# EAGLE schematic mixJTAG240 (EAGLE 6.4)
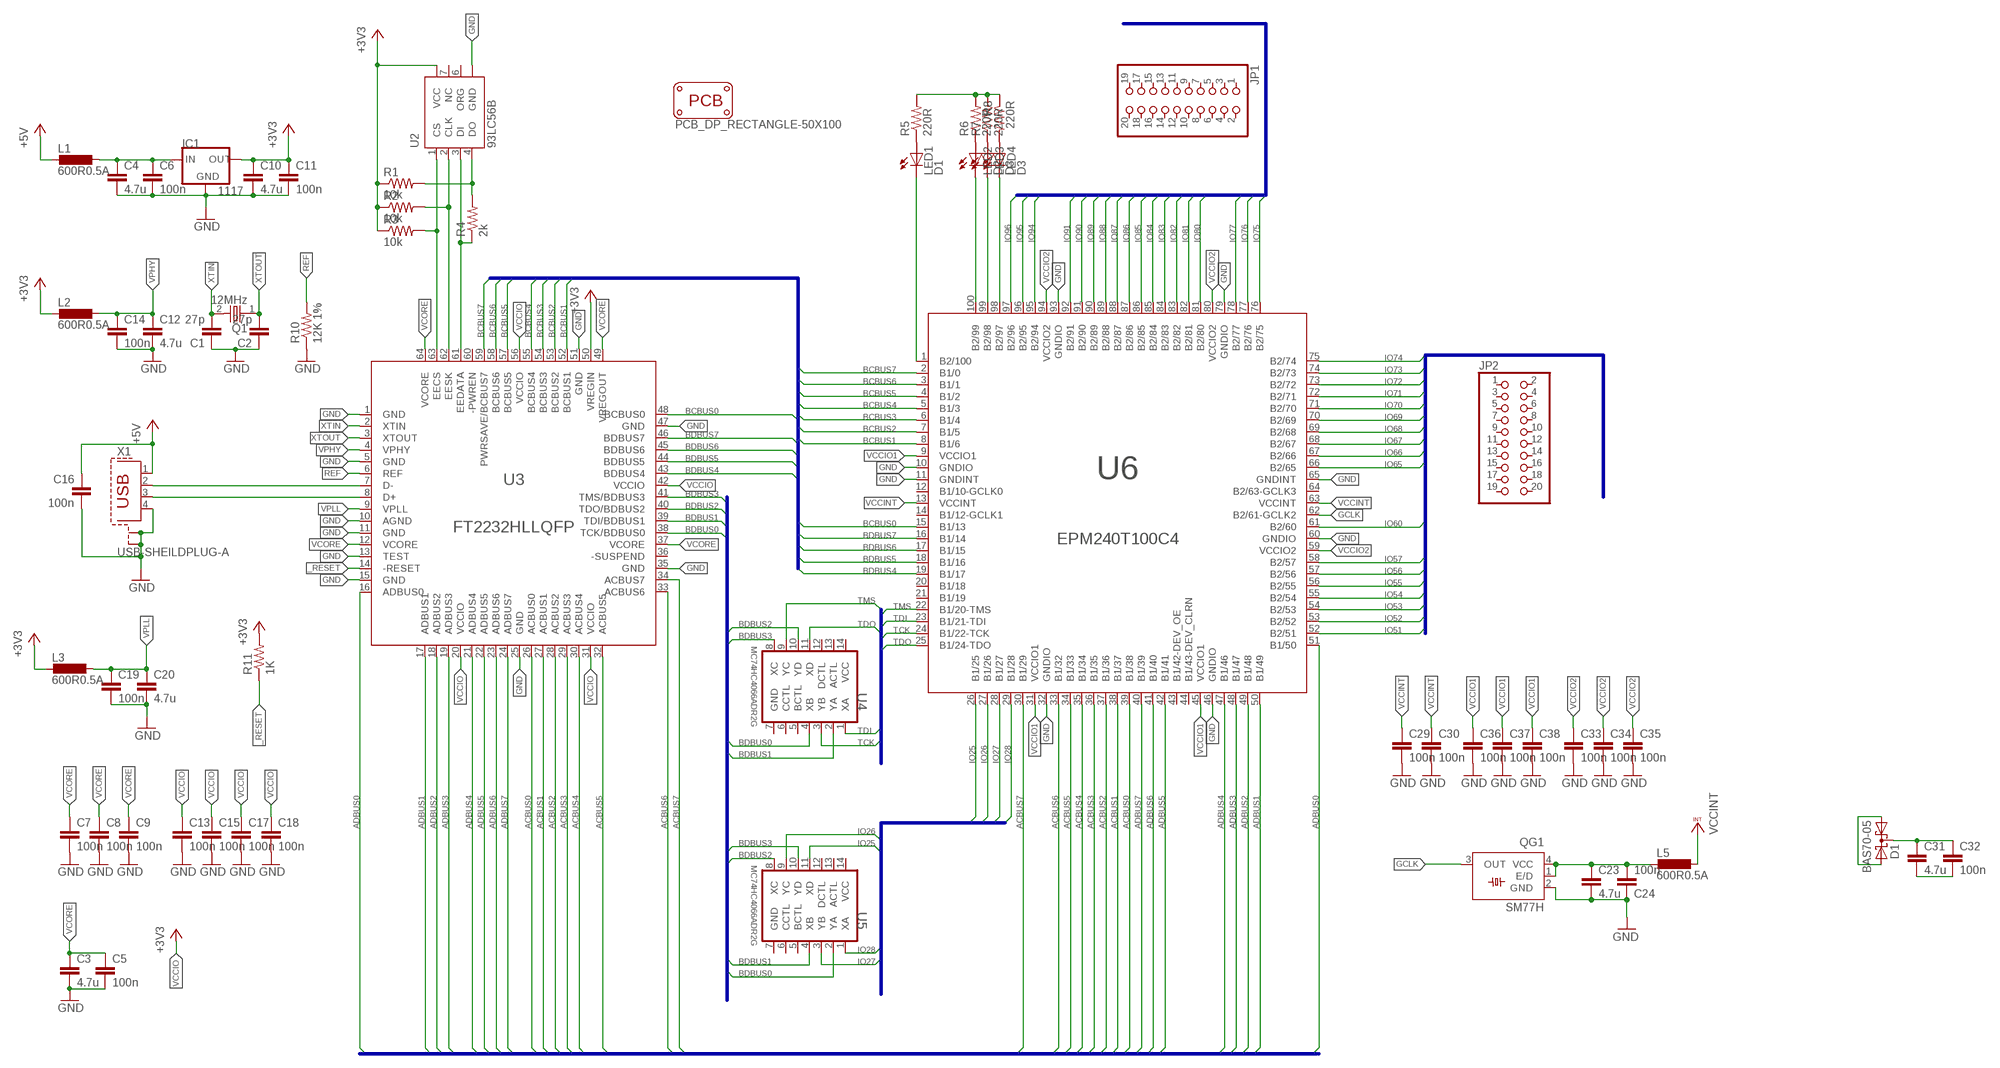
[diagram p0: schematic, sheet 1]

## Parts
C1  27p  C-EU025-025X050  [C025-025X050]
C2  27p  C-EU025-025X050  [C025-025X050]
C3  4.7u  C-EUC0805K  [C0805K]
C4  4.7u  C-EUC0805K  [C0805K]
C5  100n  C-EUC0805  [C0805]
C6  100n  C-EUC0805  [C0805]
C7  100n  C-EUC0805  [C0805]
C8  100n  C-EUC0805  [C0805]
C9  100n  C-EUC0805  [C0805]
C10  4.7u  C-EUC0805K  [C0805K]
C11  100n  C-EUC0805  [C0805]
C12  4.7u  C-EUC0805K  [C0805K]
C13  100n  C-EUC0805  [C0805]
C14  100n  C-EUC0805  [C0805]
C15  100n  C-EUC0805  [C0805]
C16  100n  C-EUC0805  [C0805]
C17  100n  C-EUC0805  [C0805]
C18  100n  C-EUC0805  [C0805]
C19  100n  C-EUC0805  [C0805]
C20  4.7u  C-EUC0805K  [C0805K]
C23  4.7u  C-EUC0805K  [C0805K]
C24  100n  C-EUC0805  [C0805]
C29  100n  C-EUC0805  [C0805]
C30  100n  C-EUC0805  [C0805]
C31  4.7u  C-EUC0805K  [C0805K]
C32  100n  C-EUC0805  [C0805]
C33  100n  C-EUC0805  [C0805]
C34  100n  C-EUC0805  [C0805]
C35  100n  C-EUC0805  [C0805]
C36  100n  C-EUC0805  [C0805]
C37  100n  C-EUC0805  [C0805]
C38  100n  C-EUC0805  [C0805]
D1  BAS70-05  [SOT23]
IC1  1117  AMS1117  [SOT223]
JP1  PINHD-2X10  [2X10]
JP2  PINHD-2X10  [2X10]
L1  600R0.5A  DO3316P  [R0805]
L2  600R0.5A  DO3316P  [R0805]
L3  600R0.5A  DO3316P  [R0805]
L5  600R0.5A  DO3316P  [R0805]
LED1  D1  LEDCHIPLED_0805  [CHIPLED_0805]
LED2  D2  LEDCHIPLED_0805  [CHIPLED_0805]
LED3  D3  LEDCHIPLED_0805  [CHIPLED_0805]
LED4  D3  LEDCHIPLED_0805  [CHIPLED_0805]
PCB1  PCB_DP_RECTANGLE-50X100  [DP10050_V1]
Q1  12MHz  XT  [HC49/S]
QG1  SM77H  [SM77H]
R1  10k  R-US_R0805  [R0805]
R2  10k  R-US_R0805  [R0805]
R3  10k  R-US_R0805  [R0805]
R4  2k  R-US_R0805  [R0805]
R5  220R  R-US_R0805  [R0805]
R6  220R  R-US_R0805  [R0805]
R7  220R  R-US_R0805  [R0805]
R8  220R  R-US_R0805  [R0805]
R10  12K 1%  R-US_R0805  [R0805]
R11  1K  R-US_R0805  [R0805]
U2  93LC56B  PIN2PIN-SOIC8  [SOIC8]
U3  FT2232HLLQFP  [LQFP-64]
U4  MC74HC4066ADR2G  [SOIC127P600X175-14N]
U5  MC74HC4066ADR2G  [SOIC127P600X175-14N]
U6  EPM240T100C4  [TQFP100]
X1  USB-SHEILDPLUG-A  [USB-A-HOLE-PLUG]

## Nets
+3V3: C10.1 C11.1 IC1.2(OUT) L2.1 L3.1 R1.1 R2.1 R3.1 R11.2 U2.8(VCC) U3.50(VREGIN)
+5V: C16.1 L1.1 X1.1
_RESET: R11.1 U3.14(-RESET)
ACBUS0: U3.26(ACBUS0) U6.39(B1/38)
ACBUS1: U3.27(ACBUS1) U6.38(B1/37)
ACBUS2: U3.28(ACBUS2) U6.37(B1/36)
ACBUS3: U3.29(ACBUS3) U6.36(B1/35)
ACBUS4: U3.30(ACBUS4) U6.35(B1/34)
ACBUS5: U3.32(ACBUS5) U6.34(B1/33)
ACBUS6: U3.33(ACBUS6) U6.33(B1/32)
ACBUS7: U3.34(ACBUS7) U6.30(B1/29)
ADBUS0: U3.16(ADBUS0) U6.51(B1/50)
ADBUS1: U3.17(ADBUS1) U6.50(B1/49)
ADBUS2: U3.18(ADBUS2) U6.49(B1/48)
ADBUS3: U3.19(ADBUS3) U6.48(B1/47)
ADBUS4: U3.21(ADBUS4) U6.47(B1/46)
ADBUS5: U3.22(ADBUS5) U6.42(B1/41)
ADBUS6: U3.23(ADBUS6) U6.41(B1/40)
ADBUS7: U3.24(ADBUS7) U6.40(B1/39)
BCBUS0: U3.48(BCBUS0) U6.15(B1/13)
BCBUS1: U3.52(BCBUS1) U6.8(B1/6)
BCBUS2: U3.53(BCBUS2) U6.7(B1/5)
BCBUS3: U3.54(BCBUS3) U6.6(B1/4)
BCBUS4: U3.55(BCBUS4) U6.5(B1/3)
BCBUS5: U3.57(BCBUS5) U6.4(B1/2)
BCBUS6: U3.58(BCBUS6) U6.3(B1/1)
BCBUS7: U3.59(PWRSAVE/BCBUS7) U6.2(B1/0)
BDBUS0: U3.38(TCK/BDBUS0) U4.4(XB) U5.2(YA)
BDBUS1: U3.39(TDI/BDBUS1) U4.2(YA) U5.4(XB)
BDBUS2: U3.40(TDO/BDBUS2) U4.10(YD) U5.8(XC)
BDBUS3: U3.41(TMS/BDBUS3) U4.8(XC) U5.10(YD)
BDBUS4: U3.43(BDBUS4) U6.19(B1/17)
BDBUS5: U3.44(BDBUS5) U6.18(B1/16)
BDBUS6: U3.45(BDBUS6) U6.17(B1/15)
BDBUS7: U3.46(BDBUS7) U6.16(B1/14)
EECS: R3.2 U2.1(CS) U3.63(EECS)
EEDATA: R4.1 U2.3(DI) U3.61(EEDATA)
EESK: R2.2 U2.2(CLK) U3.62(EESK)
GCLK: QG1.3(OUT) U6.62(B2/61-GCLK2)
GND: C1.1 C2.1 C3.2 C4.2 C5.2 C6.2 C7.2 C8.2 C9.2 C10.2 C11.2 C12.2 C13.2 C14.2 C15.2 C16.2 C17.2 C18.2 C19.2 C20.2 C23.2 C24.1 C29.2 C30.2 C33.2 C34.2 C35.2 C36.2 C37.2 C38.2 IC1.1(GND) QG1.2(GND) R10.1 U2.5(GND) U3.1(GND) U3.5(GND) U3.10(AGND) U3.11(GND) U3.13(TEST) U3.15(GND) U3.25(GND) U3.35(GND) U3.47(GND) U3.51(GND) U6.10(GNDIO) U6.11(GNDINT) U6.32(GNDIO) U6.46(GNDIO) U6.60(GNDIO) U6.65(GNDINT) U6.79(GNDIO) U6.93(GNDIO) X1.4 X1.S1 X1.S2
IO25: U5.11(XD) U6.26(B1/25)
IO26: U5.9(YC) U6.27(B1/26)
IO27: U5.3(YB) U6.28(B1/27)
IO28: U5.1(XA) U6.29(B1/28)
IO51: U6.52(B2/51)
IO52: U6.53(B2/52)
IO53: U6.54(B2/53)
IO54: U6.55(B2/54)
IO55: U6.56(B2/55)
IO56: U6.57(B2/56)
IO57: U6.58(B2/57)
IO60: U6.61(B2/60)
IO65: U6.66(B2/65)
IO66: U6.67(B2/66)
IO67: U6.68(B2/67)
IO68: U6.69(B2/68)
IO69: U6.70(B2/69)
IO70: U6.71(B2/70)
IO71: U6.72(B2/71)
IO72: U6.73(B2/72)
IO73: U6.74(B2/73)
IO74: U6.75(B2/74)
IO75: U6.76(B2/75)
IO76: U6.77(B2/76)
IO77: U6.78(B2/77)
IO80: U6.81(B2/80)
IO81: U6.82(B2/81)
IO82: U6.83(B2/82)
IO83: U6.84(B2/83)
IO84: U6.85(B2/84)
IO85: U6.86(B2/85)
IO86: U6.87(B2/86)
IO87: U6.88(B2/87)
IO88: U6.89(B2/88)
IO89: U6.90(B2/89)
IO90: U6.91(B2/90)
IO91: U6.92(B2/91)
IO94: U6.95(B2/94)
IO95: U6.96(B2/95)
IO96: U6.97(B2/96)
N$1: U3.7(D-) X1.2
N$2: U3.8(D+) X1.3
N$3: C4.1 C6.1 IC1.3(IN) L1.2
N$4: C31.1 C32.1 D1.3(C)
N$5: R5.2 R6.2 R7.2 R8.1
N$6: LED2.C U6.100(B2/99)
N$7: LED3.C U6.99(B2/98)
N$8: LED4.C U6.98(B2/97)
N$9: LED1.C U6.1(B2/100)
N$10: D1.1(A1) D1.2(A2)
N$11: C31.2 C32.2
N$13: R1.2 R4.2 U2.4(DO)
N$18: LED3.A R7.1
N$19: LED2.A R6.1
N$20: C23.1 C24.2 L5.1 QG1.1(E/D) QG1.4(VCC)
N$21: LED1.A R5.1
N$63: LED4.A R8.2
REF: R10.2 U3.6(REF)
TCK: U4.3(YB) U6.24(B1/22-TCK)
TDI: U4.1(XA) U6.23(B1/21-TDI)
TDO: U4.11(XD) U6.25(B1/24-TDO)
TMS: U4.9(YC) U6.22(B1/20-TMS)
VCCINT: C29.1 C30.1 L5.2 U6.13(VCCINT) U6.63(VCCINT)
VCCIO: C13.1 C15.1 C17.1 C18.1 U3.20(VCCIO) U3.31(VCCIO) U3.42(VCCIO) U3.56(VCCIO) ; supply symbol labelled +3V3
VCCIO1: C36.1 C37.1 C38.1 U6.9(VCCIO1) U6.31(VCCIO1) U6.45(VCCIO1)
VCCIO2: C33.1 C34.1 C35.1 U6.59(VCCIO2) U6.80(VCCIO2) U6.94(VCCIO2)
VCORE: C3.1 C5.1 C7.1 C8.1 C9.1 U3.12(VCORE) U3.37(VCORE) U3.49(VREGOUT) U3.64(VCORE)
VPHY: C12.1 C14.1 L2.2 U3.4(VPHY)
VPLL: C19.1 C20.1 L3.2 U3.9(VPLL)
XTIN: C1.2 Q1.2 U3.2(XTIN)
XTOUT: C2.2 Q1.1 U3.3(XTOUT)
Unconnected: JP1.1 JP1.2 JP1.3 JP1.4 JP1.5 JP1.6 JP1.7 JP1.8 JP1.9 JP1.10 JP1.11 JP1.12 JP1.13 JP1.14 JP1.15 JP1.16 JP1.17 JP1.18 JP1.19 JP1.20 JP2.1 JP2.2 JP2.3 JP2.4 JP2.5 JP2.6 JP2.7 JP2.8 JP2.9 JP2.10 JP2.11 JP2.12 JP2.13 JP2.14 JP2.15 JP2.16 JP2.17 JP2.18 JP2.19 JP2.20 U2.6(ORG) U2.7(NC) U3.36(-SUSPEND) U3.60(-PWREN) U4.5(BCTL) U4.6(CCTL) U4.7(GND) U4.12(DCTL) U4.13(ACTL) U5.5(BCTL) U5.6(CCTL) U5.7(GND) U5.12(DCTL) U5.13(ACTL) U6.12(B1/10-GCLK0) U6.14(B1/12-GCLK1) U6.20(B1/18) U6.21(B1/19) U6.43(B1/42-DEV_OE) U6.44(B1/43-DEV_CLRN) U6.64(B2/63-GCLK3)

## Buses
ADBUS[0..7],ACBUS[0..7]
BCBUS[0..7],BDBUS[4..7]
BDBUS[0..3]
TMS,TDI,TCK,TDO
IO[25..28]
IO[65..74],IO60,IO[51..57]
IO[94..96],IO[80..91],IO[75..77]

## Power pins joined to a net without a drawn wire
VCC: U4.14(VCC) U5.14(VCC)

## Library data of the parts
C1-C20 C23 C24 C29-C38 = rcl:C-EU: CAPACITOR, European symbol
D1 = diode:BAS70-05: Silicon Schottky Diodes General-purpose diode for high-speed switching
IC1 = bb_ldo:AMS1117
JP1 JP2 = pinhead:PINHD-2X10: PIN HEADER
L1-L3 L5 = others:DO3316P: COILCRAFT
LED1-LED4 = led:LED: LED OSRAM: - CHIPLED LG R971, LG N971, LY N971, LG Q971, LY Q971, LO R971, LY R971 LH N974, LH R974 LS Q976, LO Q976, LY Q976 LO Q996 - Hyper CHIPLED LW Q18S LB Q993, LB Q99A, LB R99A - SideLED LS A670, LO A670, LY A670, LG A670, LP A670 LB A673, LV A673, LT A673, LW A673 LH A674 LY A675 LS A676, LA A676, LO A676, LY A676, LW A676 LS A679, LY A679, LG A679 - Hyper Micro SIDELED® LS Y876, LA Y876, LO Y876, LY Y876 LT Y87S - SmartLED LW L88C, LW L88S LB L89C, LB L89S, LG L890 LS L89K, LO L89K, LY L89K LS L896, LA L896, LO L896, LY L896 - TOPLED LS T670, LO T670, LY T670, LG T670, LP T670 LSG T670, LSP T670, LSY T670, LOP T670, LYG T670 LG T671, LOG T671, LSG T671 LB T673, LV T673, LT T673, LW T673 LH T674 LS T676, LA T676, LO T676, LY T676, LB T676, LH T676, LSB T676, LW T676 LB T67C, LV T67C, LT T67C, LS T67K, LO T67K, LY T67K, LW E67C LS E67B, LA E67B, LO E67B, LY E67B, LB E67C, LV E67C, LT E67C LW T67C LS T679, LY T679, LG T679 LS T770, LO T770, LY T770, LG T770, LP T770 LB T773, LV T773, LT T773, LW T773 LH T774 LS E675, LA E675, LY E675, LS T675 LS T776, LA T776, LO T776, LY T776, LB T776 LHGB T686 LT T68C, LB T68C - Hyper Mini TOPLED® LB M676 - Mini TOPLED Santana® LG M470 LS M47K, LO M47K, LY M47K Source: http://www.osram.convergy.de LUXEON: - LUMILED® LXK2-PW12-R00, LXK2-PW12-S00, LXK2-PW14-U00, LXK2-PW14-V00 LXK2-PM12-R00, LXK2-PM12-S00, LXK2-PM14-U00 LXK2-PE12-Q00, LXK2-PE12-R00, LXK2-PE12-S00, LXK2-PE14-T00, LXK2-PE14-U00 LXK2-PB12-K00, LXK2-PB12-L00, LXK2-PB12-M00, LXK2-PB14-N00, LXK2-PB14-P00, LXK2-PB14-Q00 LXK2-PR12-L00, LXK2-PR12-M00, LXK2-PR14-Q00, LXK2-PR14-R00 LXK2-PD12-Q00, LXK2-PD12-R00, LXK2-PD12-S00 LXK2-PH12-R00, LXK2-PH12-S00 LXK2-PL12-P00, LXK2-PL12-Q00, LXK2-PL12-R00 Source: www.luxeon.com KINGBRIGHT: KA-3528ASYC Source: www.kingbright.com
PCB1 = bb_pcb:PCB_DP_RECTANGLE: Dangerous Prototypes Standard Rectangular PCB sizes
Q1 = bb_crystal:XT
QG1 = crystal:SM77H: 3.3V CMOS Clock Oscillator Source: www.pletronics.com .. sm77h%203.3v.pdf; OC_FARNELL: unknown; OC_NEWARK: unknown
R1-R8 R10 R11 = rcl:R-US_: RESISTOR, American symbol
U2 = 93LC56B:PIN2PIN-SOIC8
U3 = bb_ft2232hl:FT2232HL: FT2232H
U4 U5 = bb_MC74HC4066ADR2G:MC74HC4066ADR2G: Quad Analog Switch/Multiplexer/Demultiplexer; MPN: MC74HC4066ADR2G; OC_FARNELL: 1273200; OC_NEWARK: 84K8781; PACKAGE: SOIC-14; SUPPLIER: ON SEMICONDUCTOR
U6 = bb_epm240t100c5n:EPM240T100C4: EPM240T100 Low-cost, low-power CPLD Auto generated by make-symbol-device-package-bsdl.ulp Rev. 35 Source: www.altera.com .. epm240-io.txt; MPN: EPM240T100C4; OC_FARNELL: 1453502; OC_NEWARK: 51R9357
X1 = bb_con-usb:USB-SHEILD: USB connector with sheild